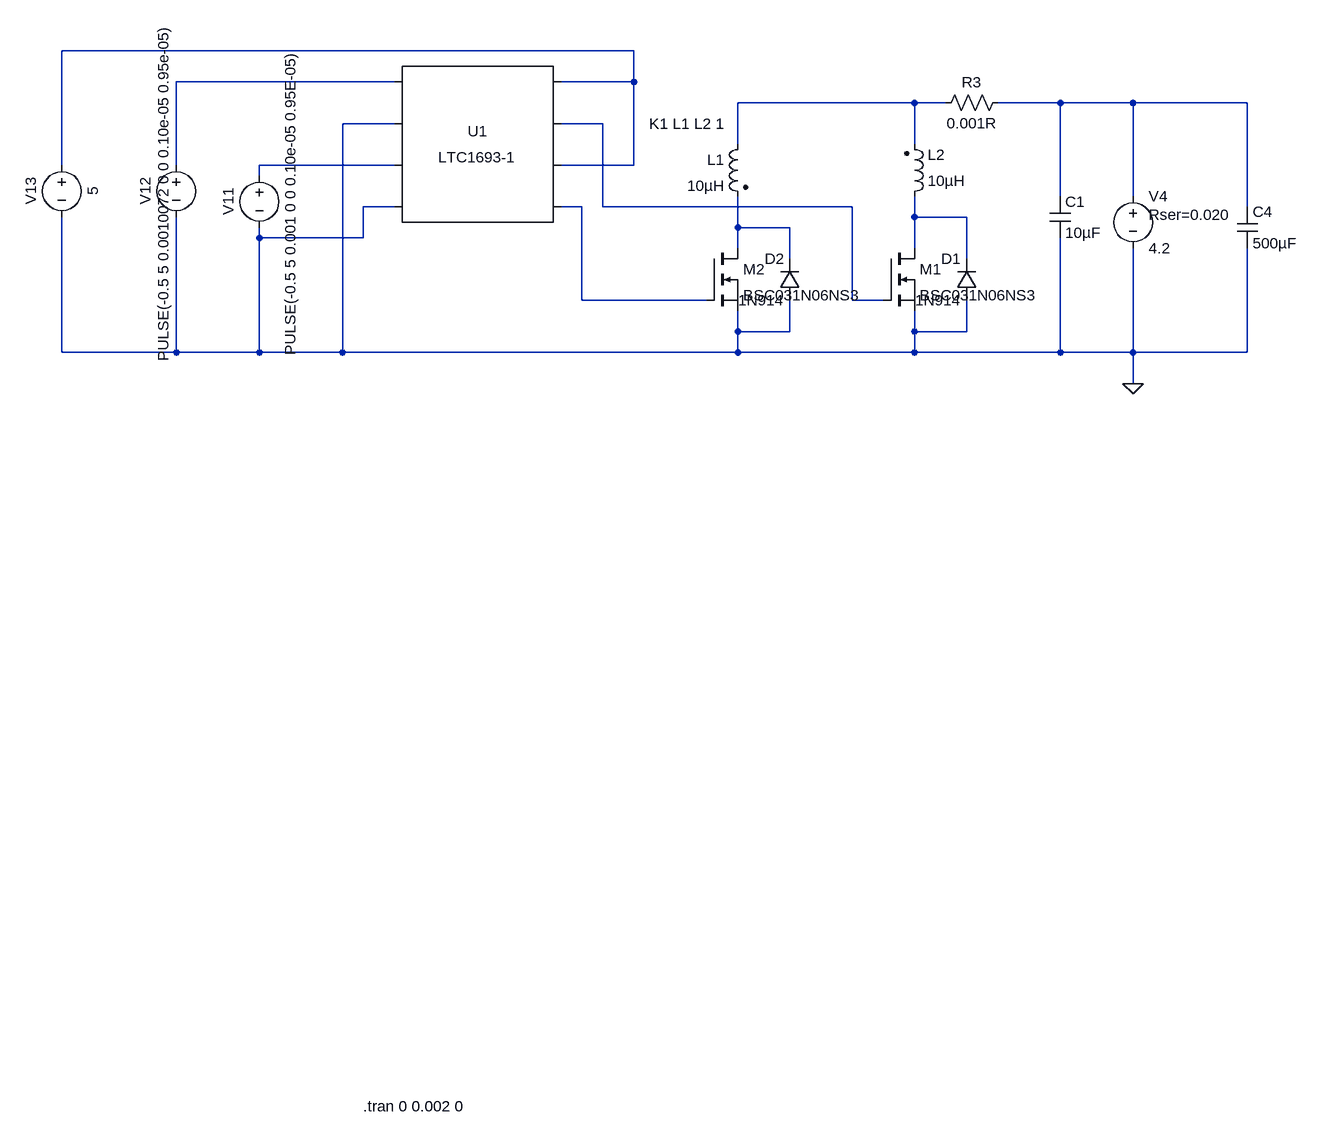
[diagram p0: schematic bms_single.asc]
bms_single.asc, the LTspice schematic file:
Version 4
SHEET 1 1480 888
WIRE -512 -752 -1392 -752
WIRE -880 -704 -1216 -704
WIRE -512 -704 -512 -752
WIRE -512 -704 -624 -704
WIRE -80 -672 -352 -672
WIRE -32 -672 -80 -672
WIRE 144 -672 48 -672
WIRE 256 -672 144 -672
WIRE 432 -672 256 -672
WIRE -880 -640 -960 -640
WIRE -560 -640 -624 -640
WIRE -352 -608 -352 -672
WIRE -80 -608 -80 -672
WIRE -1392 -576 -1392 -752
WIRE -1216 -576 -1216 -704
WIRE -880 -576 -1088 -576
WIRE -512 -576 -512 -704
WIRE -512 -576 -624 -576
WIRE -1088 -560 -1088 -576
WIRE 144 -528 144 -672
WIRE 256 -528 256 -672
WIRE -880 -512 -928 -512
WIRE -592 -512 -624 -512
WIRE -560 -512 -560 -640
WIRE -176 -512 -560 -512
WIRE 432 -512 432 -672
WIRE -80 -496 -80 -528
WIRE 0 -496 -80 -496
WIRE -352 -480 -352 -528
WIRE -272 -480 -352 -480
WIRE -1088 -464 -1088 -480
WIRE -928 -464 -928 -512
WIRE -928 -464 -1088 -464
WIRE -352 -448 -352 -480
WIRE -80 -448 -80 -496
WIRE -272 -432 -272 -480
WIRE 0 -432 0 -496
WIRE -592 -368 -592 -512
WIRE -400 -368 -592 -368
WIRE -176 -368 -176 -512
WIRE -128 -368 -176 -368
WIRE -352 -320 -352 -352
WIRE -272 -320 -272 -368
WIRE -272 -320 -352 -320
WIRE -80 -320 -80 -352
WIRE 0 -320 0 -368
WIRE 0 -320 -80 -320
WIRE -1392 -288 -1392 -496
WIRE -1216 -288 -1216 -496
WIRE -1216 -288 -1392 -288
WIRE -1088 -288 -1088 -464
WIRE -1088 -288 -1216 -288
WIRE -960 -288 -960 -640
WIRE -960 -288 -1088 -288
WIRE -352 -288 -352 -320
WIRE -352 -288 -960 -288
WIRE -80 -288 -80 -320
WIRE -80 -288 -352 -288
WIRE 144 -288 144 -464
WIRE 144 -288 -80 -288
WIRE 256 -288 256 -448
WIRE 256 -288 144 -288
WIRE 432 -288 432 -448
WIRE 432 -288 256 -288
WIRE 256 -240 256 -288
FLAG 256 -240 0
SYMBOL voltage 256 -544 R0
WINDOW 123 0 0 Left 2
WINDOW 39 24 44 Left 2
SYMATTR SpiceLine Rser=0.020
SYMATTR InstName V4
SYMATTR Value 4.2
SYMBOL ind2 -336 -624 M0
SYMATTR InstName L1
SYMATTR Value 10µH
SYMATTR Type ind
SYMBOL ind2 -96 -512 M180
WINDOW 0 36 80 Left 2
WINDOW 3 36 40 Left 2
SYMATTR InstName L2
SYMATTR Value 10µH
SYMATTR Type ind
SYMBOL nmos -128 -448 R0
SYMATTR InstName M1
SYMATTR Value BSC031N06NS3
SYMBOL diode 16 -368 R180
WINDOW 0 24 64 Left 2
WINDOW 3 24 0 Left 2
SYMATTR InstName D1
SYMATTR Value 1N914
SYMATTR Description Schottky diode
SYMATTR Type schottky
SYMBOL nmos -400 -448 R0
SYMATTR InstName M2
SYMATTR Value BSC031N06NS3
SYMBOL diode -256 -368 R180
WINDOW 0 24 64 Left 2
WINDOW 3 24 0 Left 2
SYMATTR InstName D2
SYMATTR Value 1N914
SYMATTR Description Schottky diode
SYMATTR Type schottky
SYMBOL cap 128 -528 R0
SYMATTR InstName C1
SYMATTR Value 10µF
SYMBOL cap 416 -512 R0
SYMATTR InstName C4
SYMATTR Value 500µF
SYMBOL voltage -1088 -576 R0
WINDOW 0 -32 56 VBottom 2
WINDOW 3 32 56 VTop 2
WINDOW 123 0 0 Left 2
WINDOW 39 0 0 Left 2
SYMATTR InstName V11
SYMATTR Value PULSE(-0.5 5 0.001 0 0 0.10e-05 0.95E-05)
SYMBOL voltage -1216 -592 R0
WINDOW 0 -32 56 VBottom 2
WINDOW 3 -4 56 VBottom 2
WINDOW 123 0 0 Left 2
WINDOW 39 0 0 Left 2
SYMATTR InstName V12
SYMATTR Value PULSE(-0.5 5 0.0010072 0 0 0.10e-05 0.95e-05)
SYMBOL PowerProducts\\LTC1693-1 -752 -608 R0
SYMATTR InstName U1
SYMBOL voltage -1392 -592 R0
WINDOW 0 -32 56 VBottom 2
WINDOW 3 32 56 VTop 2
WINDOW 123 0 0 Left 2
WINDOW 39 0 0 Left 2
SYMATTR InstName V13
SYMATTR Value 5
SYMBOL res 64 -688 R90
WINDOW 0 0 56 VBottom 2
WINDOW 3 32 56 VTop 2
SYMATTR InstName R3
SYMATTR Value 0.001R
TEXT -488 -640 Left 2 !K1 L1 L2 1
TEXT -928 872 Left 2 !.tran 0 0.002 0

The netlist it stands for:
* bms_single.asc
V4 N004 0 4.2 Rser=0.020
L1 N003 N009 10µH
L2 N008 N003 10µH
M1 N008 N005 0 0 BSC031N06NS3
D1 0 N008 1N914
M2 N009 N007 0 0 BSC031N06NS3
D2 0 N009 1N914
C1 N004 0 10µF
C4 N004 0 500µF
V11 N006 0 PULSE(-0.5 5 0.001 0 0 0.10e-05 0.95E-05)
V12 N002 0 PULSE(-0.5 5 0.0010072 0 0 0.10e-05 0.95e-05)
XU1 N002 0 N006 0 N007 N001 N005 N001 LTC1693-1
V13 N001 0 5
R3 N004 N003 0.001R
.model D D
.lib standard.dio
.model NMOS NMOS
.model PMOS PMOS
.lib standard.mos
K1 L1 L2 1
.tran 0 0.002 0
.lib LTC1693-1.sub
.backanno
.end